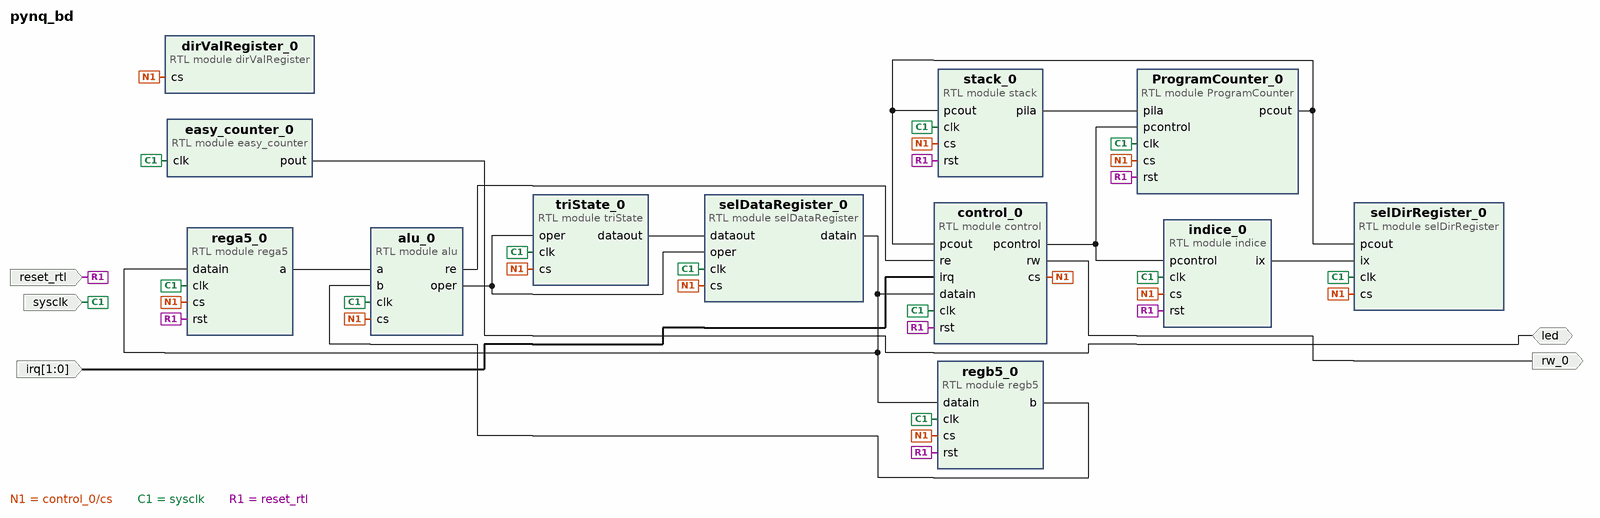
[diagram p0: block diagram of the top level]
# Vivado block design pynq_bd, xc7z020clg400-1, Vivado 2022.2
create_bd_design pynq_bd

create_bd_port -dir I -type clk sysclk
create_bd_port -dir IO led
create_bd_port -dir I -from 1 -to 0 -type intr irq
set_property -dict {CONFIG.PortWidth 2} [get_bd_ports irq]
create_bd_port -dir I -type rst reset_rtl
set_property -dict {CONFIG.POLARITY ACTIVE_LOW} [get_bd_ports reset_rtl]
create_bd_port -dir O rw_0

create_bd_cell -type module -reference easy_counter easy_counter_0
create_bd_cell -type module -reference alu alu_0
create_bd_cell -type module -reference rega5 rega5_0
create_bd_cell -type module -reference regb5 regb5_0
create_bd_cell -type module -reference selDataRegister selDataRegister_0
create_bd_cell -type module -reference triState triState_0
create_bd_cell -type module -reference ProgramCounter ProgramCounter_0
create_bd_cell -type module -reference stack stack_0
create_bd_cell -type module -reference indice indice_0
create_bd_cell -type module -reference selDirRegister selDirRegister_0
create_bd_cell -type module -reference control control_0
create_bd_cell -type module -reference dirValRegister dirValRegister_0

# ---- connections ----

connect_bd_net [get_bd_ports led] [get_bd_pins easy_counter_0/pout]
connect_bd_net [get_bd_pins control_0/cs] \
  [get_bd_pins alu_0/cs] [get_bd_pins selDataRegister_0/cs] [get_bd_pins selDirRegister_0/cs] [get_bd_pins triState_0/cs] \
  [get_bd_pins ProgramCounter_0/cs] [get_bd_pins indice_0/cs] [get_bd_pins rega5_0/cs] [get_bd_pins regb5_0/cs] \
  [get_bd_pins stack_0/cs] [get_bd_pins dirValRegister_0/cs]
connect_bd_net [get_bd_pins ProgramCounter_0/pcout] [get_bd_pins stack_0/pcout] [get_bd_pins selDirRegister_0/pcout] [get_bd_pins control_0/pcout]
connect_bd_net [get_bd_pins alu_0/oper] [get_bd_pins selDataRegister_0/oper] [get_bd_pins triState_0/oper]
connect_bd_net [get_bd_pins alu_0/re] [get_bd_pins control_0/re]
connect_bd_net -net clk_0_1 [get_bd_ports sysclk] \
  [get_bd_pins easy_counter_0/clk] [get_bd_pins alu_0/clk] [get_bd_pins control_0/clk] [get_bd_pins indice_0/clk] \
  [get_bd_pins ProgramCounter_0/clk] [get_bd_pins rega5_0/clk] [get_bd_pins regb5_0/clk] [get_bd_pins selDataRegister_0/clk] \
  [get_bd_pins selDirRegister_0/clk] [get_bd_pins stack_0/clk] [get_bd_pins triState_0/clk]
connect_bd_net [get_bd_pins control_0/pcontrol] [get_bd_pins ProgramCounter_0/pcontrol] [get_bd_pins indice_0/pcontrol]
connect_bd_net [get_bd_pins control_0/rw] [get_bd_ports rw_0]
connect_bd_net [get_bd_pins indice_0/ix] [get_bd_pins selDirRegister_0/ix]
connect_bd_net -net irq_0_1 [get_bd_ports irq] [get_bd_pins control_0/irq]
connect_bd_net [get_bd_pins rega5_0/a] [get_bd_pins alu_0/a]
connect_bd_net [get_bd_pins regb5_0/b] [get_bd_pins alu_0/b]
connect_bd_net -net rst_sysclk_100M_peripheral_aresetn [get_bd_ports reset_rtl] \
  [get_bd_pins control_0/rst] [get_bd_pins indice_0/rst] [get_bd_pins ProgramCounter_0/rst] [get_bd_pins rega5_0/rst] \
  [get_bd_pins regb5_0/rst] [get_bd_pins stack_0/rst]
connect_bd_net [get_bd_pins selDataRegister_0/datain] [get_bd_pins rega5_0/datain] [get_bd_pins regb5_0/datain] [get_bd_pins control_0/datain]
connect_bd_net [get_bd_pins stack_0/pila] [get_bd_pins ProgramCounter_0/pila]
connect_bd_net [get_bd_pins triState_0/dataout] [get_bd_pins selDataRegister_0/dataout]

validate_bd_design
save_bd_design
